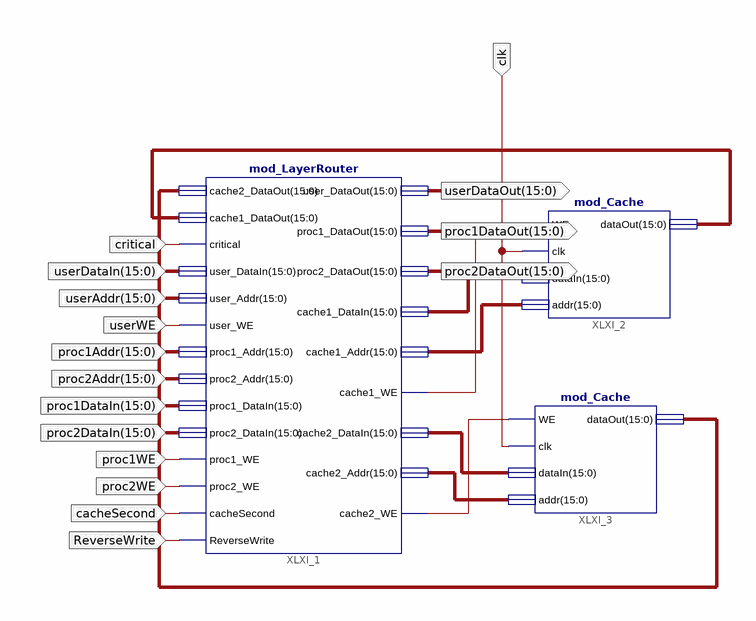
[diagram p0: schematic sheet 1]
// Xilinx ISE schematic mod_Layers.sch (spartan3e) as structural Verilog: 3 symbols, 16 ports
module mod_Layers (
  input  clk,
  input  [15:0] userDataIn,
  input  [15:0] userAddr,
  input  critical,
  input  userWE,
  input  [15:0] proc1Addr,
  input  [15:0] proc2Addr,
  input  [15:0] proc1DataIn,
  input  [15:0] proc2DataIn,
  input  proc1WE,
  input  proc2WE,
  input  cacheSecond,
  input  ReverseWrite,
  output [15:0] userDataOut,
  output [15:0] proc1DataOut,
  output [15:0] proc2DataOut
);

  wire XLXN_1, XLXN_2;
  wire [15:0] XLXN_4, XLXN_5, XLXN_6, XLXN_7, XLXN_8, XLXN_9;

  mod_LayerRouter XLXI_1 (
    .cache2_DataOut(XLXN_9), .cache1_DataOut(XLXN_6), .critical(critical), .user_DataIn(userDataIn),
    .user_Addr(userAddr), .user_WE(userWE), .proc1_Addr(proc1Addr), .proc2_Addr(proc2Addr),
    .proc1_DataIn(proc1DataIn), .proc2_DataIn(proc2DataIn), .proc1_WE(proc1WE), .proc2_WE(proc2WE),
    .ReverseWrite(ReverseWrite), .cacheSecond(cacheSecond), .user_DataOut(userDataOut),
    .proc1_DataOut(proc1DataOut), .proc2_DataOut(proc2DataOut), .cache1_DataIn(XLXN_4), .cache1_Addr(XLXN_5),
    .cache1_WE(XLXN_1), .cache2_DataIn(XLXN_7), .cache2_Addr(XLXN_8), .cache2_WE(XLXN_2));
  mod_Cache XLXI_2 (.WE(XLXN_1), .clk(clk), .dataIn(XLXN_4), .addr(XLXN_5), .dataOut(XLXN_6));
  mod_Cache XLXI_3 (.WE(XLXN_2), .clk(clk), .dataIn(XLXN_7), .addr(XLXN_8), .dataOut(XLXN_9));
endmodule
